# EAGLE design fordelings_board (EAGLE 5.07)
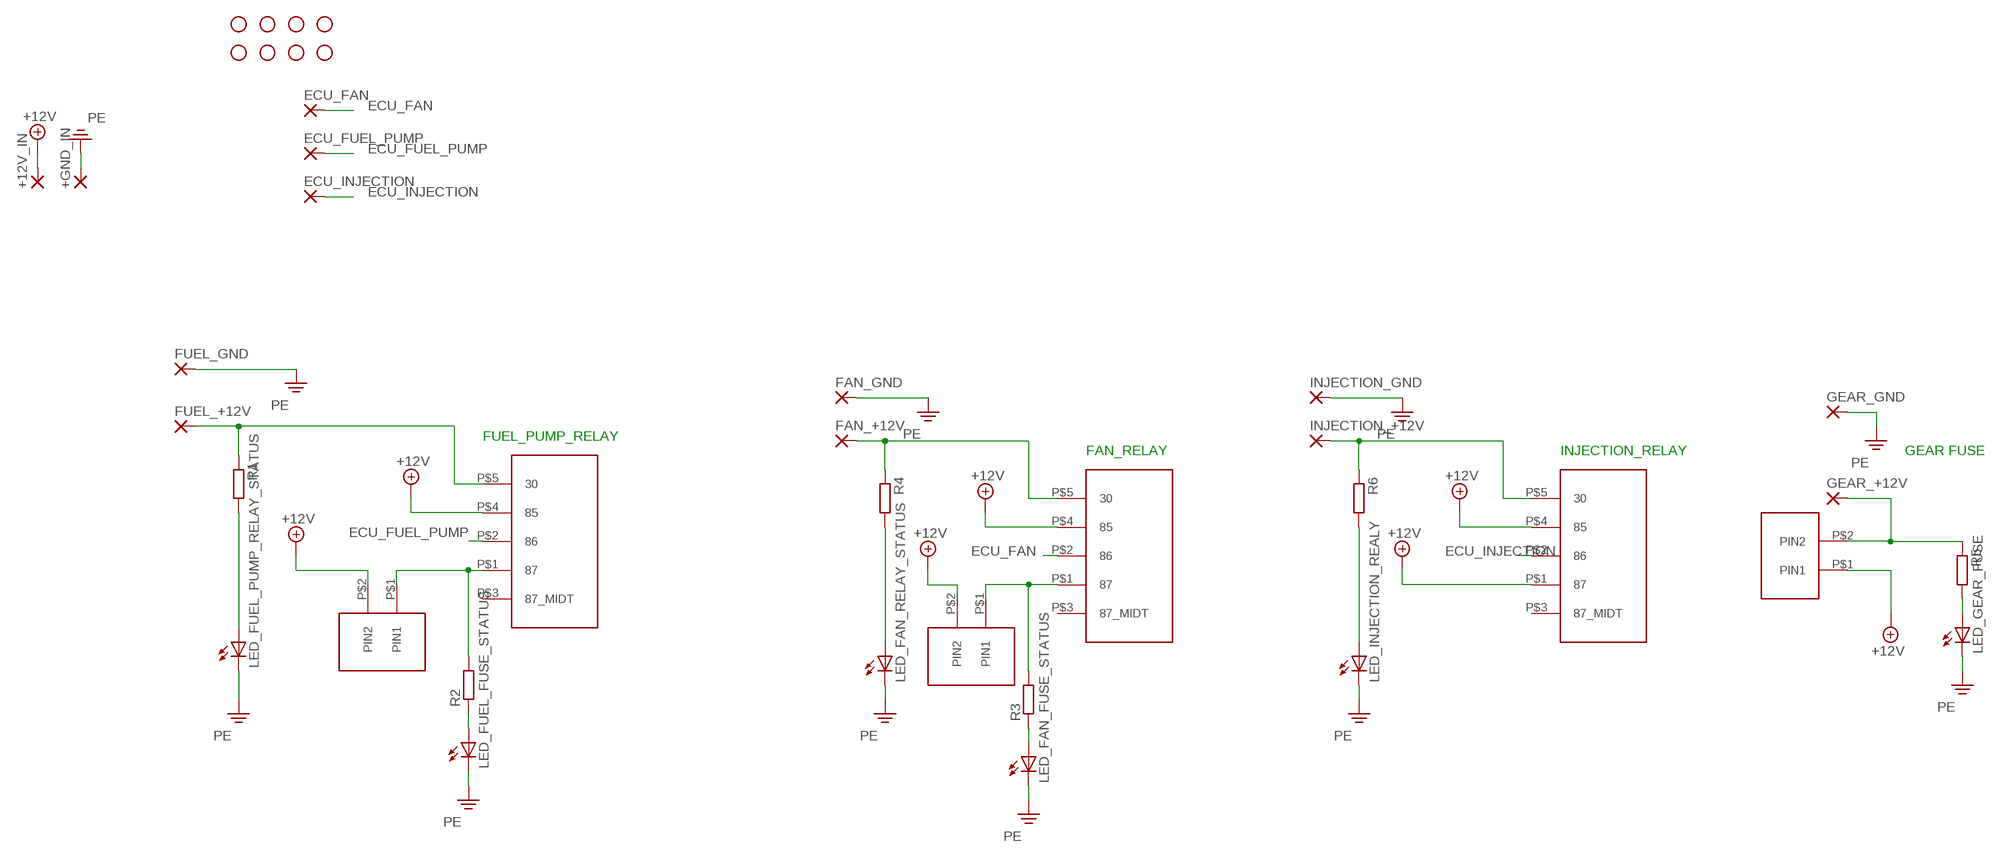
[diagram p0: schematic, sheet 1]

## Parts
+12V_IN  WIREPAD4,16O1,6  [4,16O1,6]
+GND_IN  WIREPAD4,16O1,6  [4,16O1,6]
ECU_FAN  WIREPAD4,16O1,6  [4,16O1,6]
ECU_FUEL_PUMP  WIREPAD4,16O1,6  [4,16O1,6]
ECU_INJECTION  WIREPAD4,16O1,6  [4,16O1,6]
FAN_+12V  WIREPAD4,16O1,6  [4,16O1,6]
FAN_GND  WIREPAD4,16O1,6  [4,16O1,6]
FUEL_+12V  WIREPAD4,16O1,6  [4,16O1,6]
FUEL_GND  WIREPAD4,16O1,6  [4,16O1,6]
FUEL_PUMP_RELAY  FUSE_SOCKET  [FUSE_SOCKET_12V_30A]
GEAR_+12V  WIREPAD4,16O1,6  [4,16O1,6]
GEAR_GND  WIREPAD4,16O1,6  [4,16O1,6]
INJECTION_+12V  WIREPAD4,16O1,6  [4,16O1,6]
INJECTION_GND  WIREPAD4,16O1,6  [4,16O1,6]
JP1  STAND-OFF  [STAND-OFF]
JP2  STAND-OFF  [STAND-OFF]
JP3  STAND-OFF  [STAND-OFF]
JP4  STAND-OFF  [STAND-OFF]
JP5  STAND-OFF  [STAND-OFF]
JP6  STAND-OFF  [STAND-OFF]
JP7  STAND-OFF  [STAND-OFF]
JP8  STAND-OFF  [STAND-OFF]
LED_FAN_FUSE_STATUS  LEDSMT1206  [1206]
LED_FAN_RELAY_STATUS  LEDSMT1206  [1206]
LED_FUEL_FUSE_STATUS  LEDSMT1206  [1206]
LED_FUEL_PUMP_RELAY_STATUS  LEDSMT1206  [1206]
LED_GEAR_FUSE  LEDSMT1206  [1206]
LED_INJECTION_REALY  LEDSMT1206  [1206]
R1  R-EU_M0805  [M0805]
R2  R-EU_M0805  [M0805]
R3  R-EU_M0805  [M0805]
R4  R-EU_M0805  [M0805]
R5  R-EU_M0805  [M0805]
R6  R-EU_M0805  [M0805]
U$1  FUSE_SOCKET  [FUSE_SOCKET_12V_30A]
U$2  FUSE_SOCKET  [FUSE_SOCKET_12V_30A]
U$3  LITTE_FUSE  [LITTE_FUSE_PAC]
U$4  LITTE_FUSE  [LITTE_FUSE_PAC]
U$5  LITTE_FUSE  [LITTE_FUSE_PAC]

## Nets
+12V: +12V_IN.1(P) FUEL_PUMP_RELAY.P$4 U$1.P$1 U$1.P$4 U$2.P$4 U$3.P$1(PIN1) U$4.P$2(PIN2) U$5.P$2(PIN2)
ECU_FAN: ECU_FAN.1(P) U$2.P$2
ECU_FUEL_PUMP: ECU_FUEL_PUMP.1(P) FUEL_PUMP_RELAY.P$2
ECU_INJECTION: ECU_INJECTION.1(P) U$1.P$2
N$1: FUEL_PUMP_RELAY.P$1 R2.2 U$4.P$1(PIN1)
N$3: LED_FUEL_FUSE_STATUS.A R2.1
N$4: LED_FAN_RELAY_STATUS.A R4.2
N$5: R3.2 U$2.P$1 U$5.P$1(PIN1)
N$6: INJECTION_+12V.1(P) R6.1 U$1.P$5
N$7: GEAR_+12V.1(P) R5.1 U$3.P$2(PIN2)
N$8: LED_GEAR_FUSE.A R5.2
N$11: LED_INJECTION_REALY.A R6.2
N$12: FAN_+12V.1(P) R4.1 U$2.P$5
N$13: LED_FUEL_PUMP_RELAY_STATUS.A R1.2
N$14: FUEL_+12V.1(P) FUEL_PUMP_RELAY.P$5 R1.1
N$15: LED_FAN_FUSE_STATUS.A R3.1
PE: +GND_IN.1(P) FAN_GND.1(P) FUEL_GND.1(P) GEAR_GND.1(P) INJECTION_GND.1(P) LED_FAN_FUSE_STATUS.C LED_FAN_RELAY_STATUS.C LED_FUEL_FUSE_STATUS.C LED_FUEL_PUMP_RELAY_STATUS.C LED_GEAR_FUSE.C LED_INJECTION_REALY.C
Unconnected: FUEL_PUMP_RELAY.P$3(87_MIDT) U$1.P$3(87_MIDT) U$2.P$3(87_MIDT)

## Notes on the sheet
- FUEL_PUMP_RELAY
- FAN_RELAY | INJECTION_RELAY | GEAR FUSE

## Library data of the parts
+12V_IN +GND_IN ECU_FAN ECU_FUEL_PUMP ECU_INJECTION FAN_+12V FAN_GND FUEL_+12V FUEL_GND GEAR_+12V GEAR_GND INJECTION_+12V INJECTION_GND = wirepad:WIREPAD: Wire PAD connect wire on PCB
FUEL_PUMP_RELAY U$1 U$2 = unicorn_v2:FUSE_SOCKET
JP1-JP8 = SparkFun:STAND-OFF: Stand Off This is the mechanical footprint for a #4 phillips button head screw. Use the keepout ring to avoid running the screw head into surrounding components. SKU : PRT-00447
LED_FAN_FUSE_STATUS LED_FAN_RELAY_STATUS LED_FUEL_FUSE_STATUS LED_FUEL_PUMP_RELAY_STATUS LED_GEAR_FUSE LED_INJECTION_REALY = led:LED: LED OSRAM: - CHIPLED LG R971, LG N971, LY N971, LG Q971, LY Q971, LO R971, LY R971 LH N974, LH R974 LS Q976, LO Q976, LY Q976 LO Q996 - Hyper CHIPLED LW Q18S LB Q993, LB Q99A, LB R99A - SideLED LS A670, LO A670, LY A670, LG A670, LP A670 LB A673, LV A673, LT A673, LW A673 LH A674 LY A675 LS A676, LA A676, LO A676, LY A676, LW A676 LS A679, LY A679, LG A679 - Hyper Micro SIDELED® LS Y876, LA Y876, LO Y876, LY Y876 LT Y87S - SmartLED LW L88C, LW L88S LB L89C, LB L89S, LG L890 LS L89K, LO L89K, LY L89K LS L896, LA L896, LO L896, LY L896 - TOPLED LS T670, LO T670, LY T670, LG T670, LP T670 LSG T670, LSP T670, LSY T670, LOP T670, LYG T670 LG T671, LOG T671, LSG T671 LB T673, LV T673, LT T673, LW T673 LH T674 LS T676, LA T676, LO T676, LY T676, LB T676, LH T676, LSB T676, LW T676 LB T67C, LV T67C, LT T67C, LS T67K, LO T67K, LY T67K, LW E67C LS E67B, LA E67B, LO E67B, LY E67B, LB E67C, LV E67C, LT E67C LW T67C LS T679, LY T679, LG T679 LS T770, LO T770, LY T770, LG T770, LP T770 LB T773, LV T773, LT T773, LW T773 LH T774 LS E675, LA E675, LY E675, LS T675 LS T776, LA T776, LO T776, LY T776, LB T776 LHGB T686 LT T68C, LB T68C - Hyper Mini TOPLED® LB M676 - Mini TOPLED Santana® LG M470 LS M47K, LO M47K, LY M47K Source: http://www.osram.convergy.de LUXEON: - LUMILED® LXK2-PW12-R00, LXK2-PW12-S00, LXK2-PW14-U00, LXK2-PW14-V00 LXK2-PM12-R00, LXK2-PM12-S00, LXK2-PM14-U00 LXK2-PE12-Q00, LXK2-PE12-R00, LXK2-PE12-S00, LXK2-PE14-T00, LXK2-PE14-U00 LXK2-PB12-K00, LXK2-PB12-L00, LXK2-PB12-M00, LXK2-PB14-N00, LXK2-PB14-P00, LXK2-PB14-Q00 LXK2-PR12-L00, LXK2-PR12-M00, LXK2-PR14-Q00, LXK2-PR14-R00 LXK2-PD12-Q00, LXK2-PD12-R00, LXK2-PD12-S00 LXK2-PH12-R00, LXK2-PH12-S00 LXK2-PL12-P00, LXK2-PL12-Q00, LXK2-PL12-R00 Source: www.luxeon.com KINGBRIGHT: KA-3528ASYC Source: www.kingbright.com
R1-R6 = rcl:R-EU_: RESISTOR, European symbol
U$3-U$5 = unicorn_v2:LITTE_FUSE

## Board
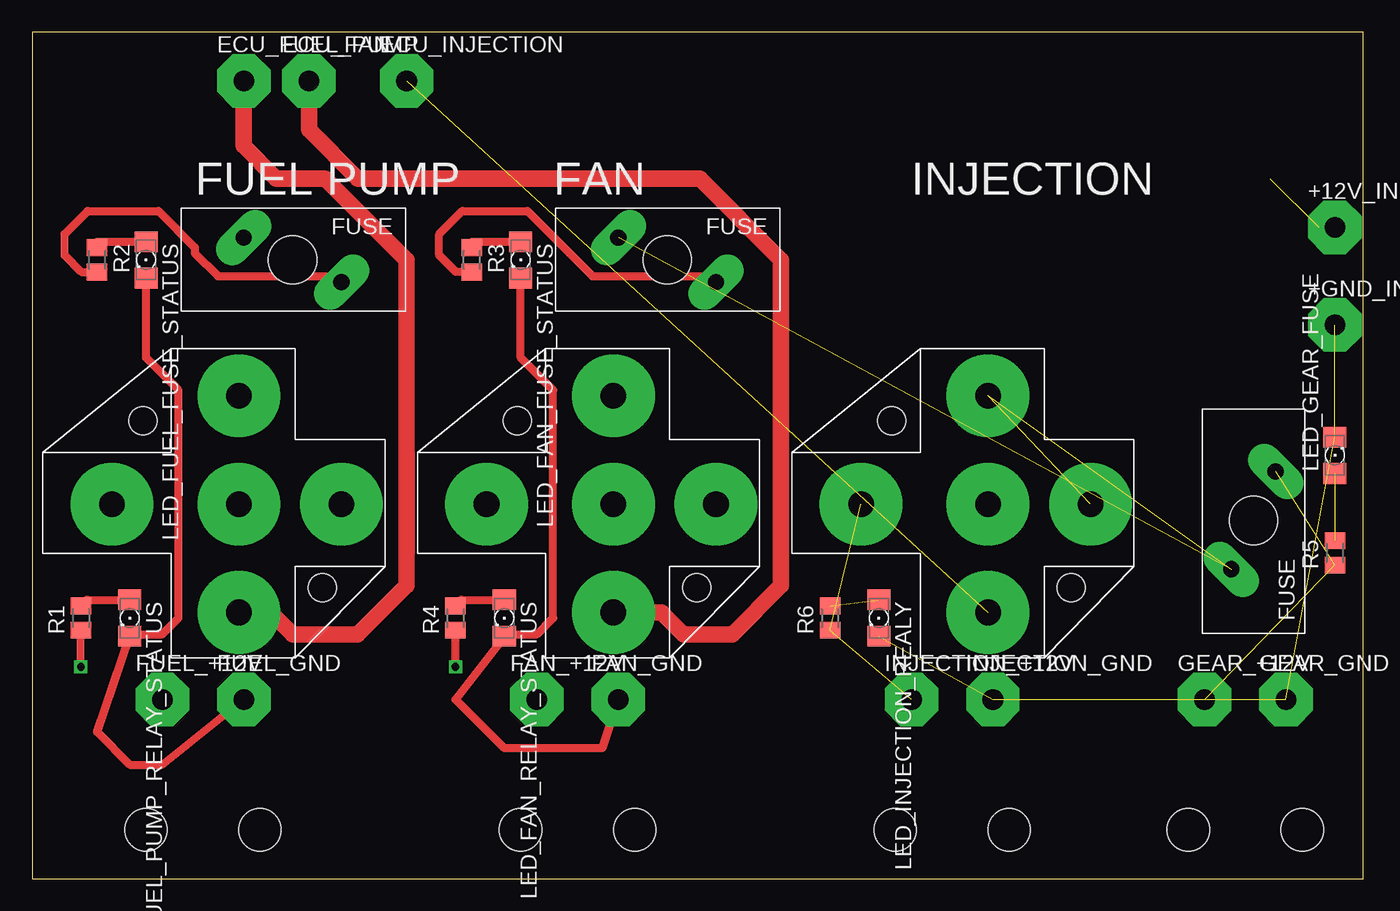
[diagram p1: board, top side]
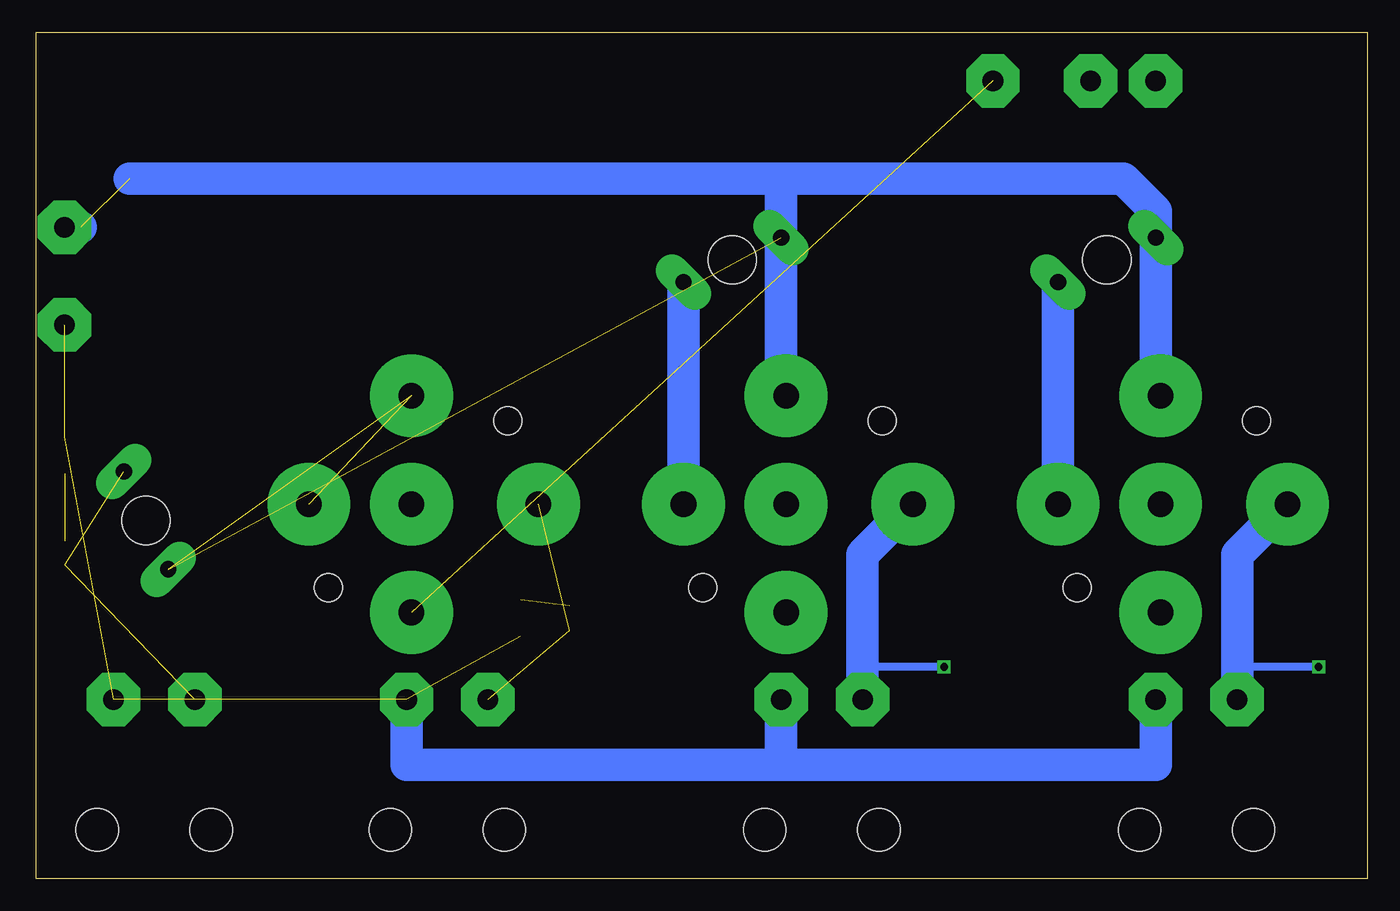
[diagram p2: board, bottom side, seen from below]

Size 103.81 x 66.03 mm. Coordinates in mm from the lower left corner, seen from the top.
Outline: 0,0 103.81,0 103.81,66.03 0,66.03 0,0
Copper layers (1*16): Top 0.035mm / dielectric 1.5mm / Bottom 0.035mm
Design rules "default": minimum track width 10mil, minimum drill 24mil, track to track 8mil, track to pad 8mil, pad to pad 8mil, via to via 8mil, smd to smd 8mil, copper to edge 40mil, drill to drill 8mil, minimum pad ring 10mil, minimum via ring 8mil, stop-mask expansion 4mil, vias tented up to drill 0mil, thermal gap 10mil

### Footprints (pad centres in the part's own frame; a part is rotated, then mirrored left to right if it is on the bottom)
4,16O1,6 = drill 1.6 pad 4.166 octagon: 1 0,0
FUSE_SOCKET_12V_30A = drill 2 pad 6.452 round: P$1 0,0; P$2 8,8.45; P$3 8,0; P$4 8,-8.45; P$5 17.9,0 | hole 2.2: 1.5,6.5; 15.5,-6.5
STAND-OFF = hole 3.302: 0,0
1206 = smd 1.6 x 1.803: A -1.422,0; C 1.422,0
M0805 = smd 1.3 x 1.6: 1 -0.95,0; 2 0.95,0
LITTE_FUSE_PAC = drill 1.27 pad 2.54 long: P$1 -1.73,-3.81; P$2 1.73,3.81 | hole 3.78: 0,0

### Placement (x,y rotation side)
+12V_IN  101.6,50.8 0 top
+GND_IN  101.6,43.18 0 top
ECU_FAN  21.59,62.23 0 top
ECU_FUEL_PUMP  16.51,62.23 0 top
ECU_INJECTION  29.21,62.23 0 top
FAN_+12V  39.37,13.97 0 top
FAN_GND  45.72,13.97 0 top
FUEL_+12V  10.16,13.97 0 top
FUEL_GND  16.51,13.97 0 top
FUEL_PUMP_RELAY  24.13,29.21 180 top
GEAR_+12V  91.44,13.97 0 top
GEAR_GND  97.79,13.97 0 top
INJECTION_+12V  68.58,13.97 0 top
INJECTION_GND  74.93,13.97 0 top
JP1  8.89,3.81 0 top
JP2  17.78,3.81 0 top
JP3  38.1,3.81 0 top
JP4  46.99,3.81 0 top
JP5  67.31,3.81 0 top
JP6  76.2,3.81 0 top
JP7  90.17,3.81 0 top
JP8  99.06,3.81 0 top
LED_FAN_FUSE_STATUS  38.1,48.26 270 top
LED_FAN_RELAY_STATUS  36.83,20.32 270 top
LED_FUEL_FUSE_STATUS  8.89,48.26 270 top
LED_FUEL_PUMP_RELAY_STATUS  7.62,20.32 270 top
LED_GEAR_FUSE  101.6,33.02 90 top
LED_INJECTION_REALY  66.04,20.32 270 top
R1  3.81,20.32 90 top
R2  5.08,48.26 270 top
R3  34.29,48.26 270 top
R4  33.02,20.32 90 top
R5  101.6,25.4 90 top
R6  62.23,20.32 90 top
U$1  82.55,29.21 180 top
U$2  53.34,29.21 180 top
U$3  95.25,27.94 0 top
U$4  20.32,48.26 90 top
U$5  49.53,48.26 90 top

### Tracks (layer width: path | path; a pad name or v marks a point on that pad's centre or on a via)
+12V  (4 unrouted)
  Bottom 2.54: FUEL_PUMP_RELAY.P$4 16.51,38.04 U$4.P$2 16.51,52.07 19.05,54.61 45.72,54.61 | U$2.P$4 45.72,38.04 U$5.P$2 45.72,54.61 | 100.33,50.8 +12V_IN.1 | 45.72,54.61 96.52,54.61
ECU_FAN
  Top 1.27: ECU_FAN.1 21.59,58.42 25.4,54.61 52.07,54.61 58.42,48.26 58.42,22.86 54.61,19.05 50.8,19.05 49.09,20.76 U$2.P$2
ECU_FUEL_PUMP
  Top 1.27: FUEL_PUMP_RELAY.P$2 18.61,20.76 20.32,19.05 25.4,19.05 29.21,22.86 29.21,48.26 22.86,54.61 19.05,54.61 16.51,57.15 ECU_FUEL_PUMP.1
ECU_INJECTION  (1 unrouted)
N$1
  Top 0.61: R2.2 3.85,47.31 2.54,48.62 2.54,50.27 4.34,52.07 9.86,52.07 12.7,49.23 12.7,48.79 14.5,46.99 24.13,46.99 U$4.P$1
  Bottom 2.54: U$4.P$1 FUEL_PUMP_RELAY.P$1
N$3
  Top 0.61: LED_FUEL_FUSE_STATUS.A 5.08,49.68 R2.1
N$4
  Top 0.61: LED_FAN_RELAY_STATUS.A 33.49,21.74 R4.2
N$5
  Top 0.61: R3.2 33.06,47.31 31.75,48.62 31.75,50.27 33.55,52.07 38.63,52.07 41.91,48.79 43.71,46.99 53.34,46.99 U$5.P$1
  Bottom 2.54: U$5.P$1 U$2.P$1
N$6  (2 unrouted)
N$7  (2 unrouted)
N$8  (1 unrouted)
N$11  (1 unrouted)
N$12  (via drill 0.6)
  Top 0.61: v33.02,16.51 R4.1
  Bottom 0.61: v33.02,16.51 39.37,16.51
  Bottom 2.54: U$2.P$5 39.37,25.28 39.37,16.51 FAN_+12V.1
N$13
  Top 0.61: LED_FUEL_PUMP_RELAY_STATUS.A 4.28,21.74 R1.2
N$14  (via drill 0.6)
  Top 0.61: v3.81,16.51 R1.1
  Bottom 0.61: v3.81,16.51 10.16,16.51
  Bottom 2.54: FUEL_PUMP_RELAY.P$5 10.16,25.28 10.16,16.51 FUEL_+12V.1
N$15
  Top 0.61: LED_FAN_FUSE_STATUS.A 34.29,49.68 R3.1
PE  (4 unrouted)
  Top 0.61: LED_FAN_FUSE_STATUS.C 38.1,40.64 40.64,38.1 40.64,20.32 39.37,19.05 36.98,19.05 LED_FAN_RELAY_STATUS.C 33.02,13.97 36.83,10.16 44.45,10.16 FAN_GND.1 | LED_FUEL_FUSE_STATUS.C 8.89,40.64 11.43,38.1 11.43,20.32 10.16,19.05 7.77,19.05 LED_FUEL_PUMP_RELAY_STATUS.C 5.08,11.43 7.62,8.89 10.16,8.89 FUEL_GND.1
  Bottom 2.54: FUEL_GND.1 16.51,8.89 45.72,8.89 | 45.72,8.89 74.93,8.89 INJECTION_GND.1 | 45.72,8.89 FAN_GND.1

### Text on the board
Top: RELAY_STYRE_HULDER SKAL LAVES, KUN MARKERET NU
tPlace: FUEL PUMP | FAN | INJECTION